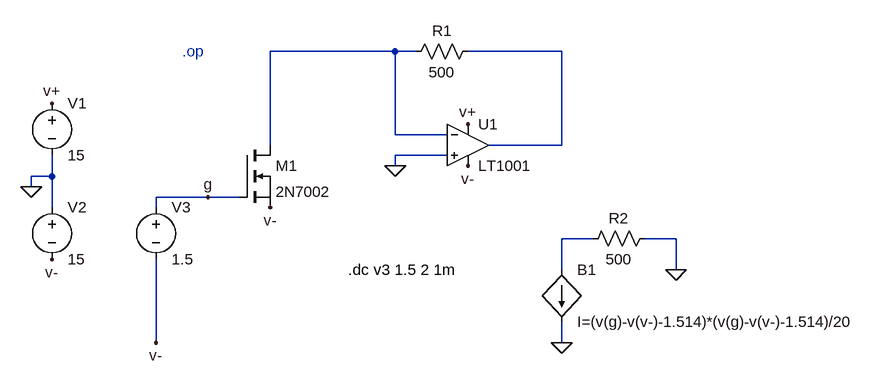
[diagram p0: schematic MOS transf.asc]
MOS transf.asc, the LTspice schematic file:
Version 4
SHEET 1 1244 680
WIRE 400 0 208 0
WIRE 432 0 400 0
WIRE 656 0 512 0
WIRE 400 128 400 0
WIRE 480 128 400 128
WIRE 208 144 208 0
WIRE 656 144 656 0
WIRE 656 144 544 144
WIRE 480 160 400 160
WIRE 400 176 400 160
WIRE -128 192 -128 160
WIRE -128 192 -160 192
WIRE -160 208 -160 192
WIRE 112 224 32 224
WIRE 160 224 112 224
WIRE -128 240 -128 192
WIRE 32 240 32 224
WIRE 704 288 656 288
WIRE 832 288 784 288
WIRE 656 336 656 288
WIRE 832 336 832 288
WIRE 32 448 32 320
WIRE 656 448 656 416
FLAG -160 208 0
FLAG -128 80 v+
FLAG -128 320 v-
FLAG 512 112 v+
FLAG 512 176 v-
FLAG 400 176 0
FLAG 208 240 v-
FLAG 32 448 v-
FLAG 112 224 g
FLAG 656 448 0
FLAG 832 336 0
DATAFLAG 656 96 ""
SYMBOL nmos 160 144 R0
SYMATTR InstName M1
SYMATTR Value 2N7002
SYMBOL voltage -128 64 R0
WINDOW 123 0 0 Left 0
WINDOW 39 0 0 Left 0
SYMATTR InstName V1
SYMATTR Value 15
SYMBOL voltage -128 224 R0
WINDOW 123 0 0 Left 0
WINDOW 39 0 0 Left 0
SYMATTR InstName V2
SYMATTR Value 15
SYMBOL OpAmps\\LT1001 512 80 R0
SYMATTR InstName U1
SYMBOL res 528 -16 R90
WINDOW 0 0 56 VBottom 2
WINDOW 3 32 56 VTop 2
SYMATTR InstName R1
SYMATTR Value 500
SYMBOL voltage 32 224 R0
WINDOW 123 0 0 Left 0
WINDOW 39 0 0 Left 0
SYMATTR InstName V3
SYMATTR Value 1.5
SYMBOL bi 656 336 R0
SYMATTR InstName B1
SYMATTR Value I=(v(g)-v(v-)-1.514)*(v(g)-v(v-)-1.514)/20
SYMBOL res 800 272 R90
WINDOW 0 0 56 VBottom 2
WINDOW 3 32 56 VTop 2
SYMATTR InstName R2
SYMATTR Value 500
TEXT 72 0 Left 2 ;.op
TEXT 328 336 Left 2 !.dc v3 1.5 2 1m

The netlist it stands for:
* MOS transf.asc
M1 N001 g v- v- 2N7002
V1 v+ 0 15
V2 0 v- 15
XU1 0 N001 v+ v- N002 LT1001  ; pins In+ In- V+ V- OUT
R1 N002 N001 500
V3 g v- 1.5
B1 N003 0 I=(v(g)-v(v-)-1.514)*(v(g)-v(v-)-1.514)/20
R2 0 N003 500
.model NMOS NMOS
.model PMOS PMOS
.lib standard.mos
* .op
.dc v3 1.5 2 1m
.lib LTC.lib
.backanno
.end